# Altium schematic sheet MOSFETs.SchDoc
size A; SheetNumber: 6; SheetTotal: 8
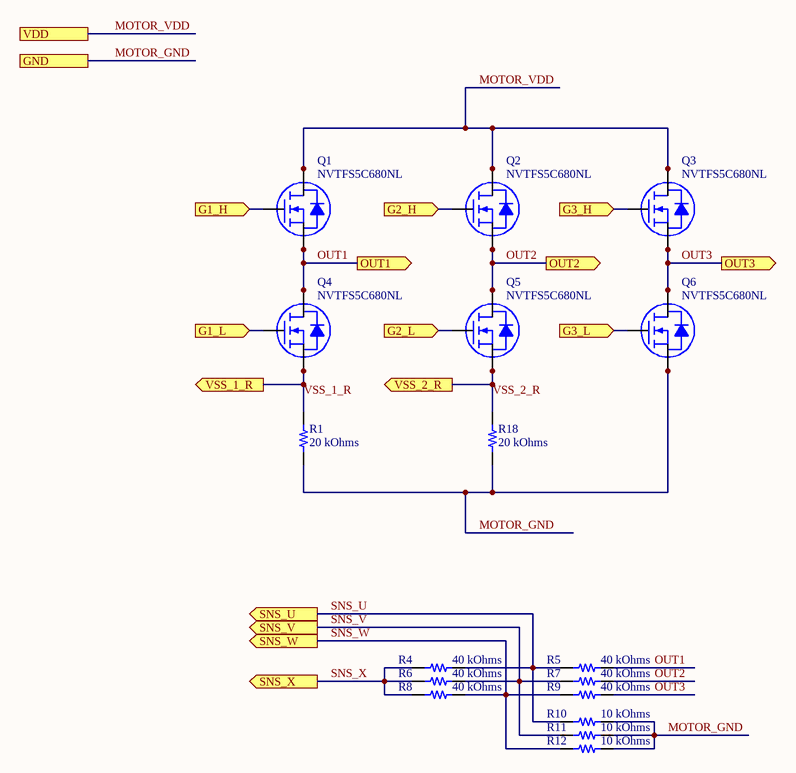
[diagram p0: MOSFETs.SchDoc]

## Parts
Q1  NVTFS5C680NL  [NVTFS015N04CTAG]
Q2  NVTFS5C680NL  [NVTFS015N04CTAG]
Q3  NVTFS5C680NL  [NVTFS015N04CTAG]
Q4  NVTFS5C680NL  [NVTFS015N04CTAG]
Q5  NVTFS5C680NL  [NVTFS015N04CTAG]
Q6  NVTFS5C680NL  [NVTFS015N04CTAG]
R1  20 kOhms  [RES 0805_2012]
R4  40 kOhms  [RES 0402_1005]
R5  40 kOhms  [RES 0402_1005]
R6  40 kOhms  [RES 0402_1005]
R7  40 kOhms  [RES 0402_1005]
R8  40 kOhms  [RES 0402_1005]
R9  40 kOhms  [RES 0402_1005]
R10  10 kOhms  [RES 0402_1005]
R11  10 kOhms  [RES 0402_1005]
R12  10 kOhms  [RES 0402_1005]
R18  20 kOhms  [RES 0805_2012]

## Ports
G1_H (in), G1_L (in), G2_H (in), G2_L (in), G3_H (in), G3_L (in), GND, OUT1 (out), OUT2 (out), OUT3 (out), SNS_U (out), SNS_V (out), SNS_W (out), SNS_X (out), VDD, VSS_1_R (out), VSS_2_R (out)

## Nets
G1_H: Q1.4(G) ; port G1_H
G1_L: Q4.4(G) ; port G1_L
G2_H: Q2.4(G) ; port G2_H
G2_L: Q5.4(G) ; port G2_L
G3_H: Q3.4(G) ; port G3_H
G3_L: Q6.4(G) ; port G3_L
MOTOR_GND: Q6.1(S) Q6.2(S) Q6.3(S) R1.1 R10.1 R11.1 R12.1 R18.1 ; port GND
MOTOR_VDD: Q1.5(D) Q1.6(D) Q1.7(D) Q1.8(D) Q2.5(D) Q2.6(D) Q2.7(D) Q2.8(D) Q3.5(D) Q3.6(D) Q3.7(D) Q3.8(D) ; port VDD
OUT1: Q1.1(S) Q1.2(S) Q1.3(S) Q4.5(D) Q4.6(D) Q4.7(D) Q4.8(D) R5.2 ; port OUT1
OUT2: Q2.1(S) Q2.2(S) Q2.3(S) Q5.5(D) Q5.6(D) Q5.7(D) Q5.8(D) R7.2 ; port OUT2
OUT3: Q3.1(S) Q3.2(S) Q3.3(S) Q6.5(D) Q6.6(D) Q6.7(D) Q6.8(D) R9.2 ; port OUT3
SNS_U: R4.2 R5.1 R10.2 ; port SNS_U
SNS_V: R6.2 R7.1 R11.2 ; port SNS_V
SNS_W: R8.2 R9.1 R12.2 ; port SNS_W
SNS_X: R4.1 R6.1 R8.1 ; port SNS_X
VSS_1_R: Q4.1(S) Q4.2(S) Q4.3(S) R1.2 ; port VSS_1_R
VSS_2_R: Q5.1(S) Q5.2(S) Q5.3(S) R18.2 ; port VSS_2_R

## Library data of the parts
Q1-Q6 = NVTFS5C680NL: N-FET
R1 R18 = PCAN0805E2002BST5: RES SMD 20K OHM 0.1% 1W 0805; Manufacturer: Vishay Thin Film; Temperature Coefficient: ±25ppm/°C; Part Number: PCAN0805E2002BST5; Value: 20 kOhms; ComponentLink1Description: Datasheet; ComponentLink1URL: http://www.vishay.com/docs/60125/pcan.pdf; ComponentLink2Description: DigiKey Link; ComponentLink2URL: http://digikey.com/product-detail/en/vishay-thin-film/PCAN0805E2002BST5/764-1242-1-ND/6003316; Composition: Thin Film; Device Package: 0805 (2012 Metric); Features: Flame Proof, Moisture Resistant, Safety; Height - Seated (Max): 0.018" (0.46mm); LastUpdated: 8/26/2022 12:02:22 PM; Lifecycle Status: Active; Minimum Order: 1; Number of Terminations: 2; Operating Temperature: -55°C ~ 155°C; Package / Case: 0805 (2012 Metric); Packaging: TapeAndReel; PartId: 32096; Part Status: Active; Power (Watts): 1W; Price: 0.59; Resistance: 20 kOhms; Series: PCAN; Size / Dimension: 0.080" L x 0.050" W (2.03mm x 1.27mm); Supplier 1: DigiKey; Supplier Part Number 1: 764-1242-1-ND; Supplier Device Package: 0805; Tolerance: ±0.1%
R4-R12 = RK73H1ETTP1432F: RES 14.3K OHM 1% 1/10W 0402; Manufacturer: KOA Speer Electronics, Inc.; Power (Watts): 0.1W, 1/10W; Resistance: 14.3 kOhms; Temperature Coefficient: ±100ppm/°C; Part Number: RK73H1ETTP1432F; ComponentLink1Description: Datasheet; ComponentLink1URL: http://www.koaspeer.com/catimages/Products/RK73H/RK73H.pdf; ComponentLink2Description: DigiKey Link; ComponentLink2URL: https://www.digikey.com/en/products/detail/koa-speer-electronics-inc/RK73H1ETTP1432F/9844351; Composition: Thick Film; Device Package: 0402 (1005 Metric); Features: Automotive AEC-Q200, Moisture Resistant; Height - Seated (Max): 0.016" (0.40mm); LastUpdated: 8/14/2022 9:23:49 PM; Lifecycle Status: Active; Minimum Order: 1; Number of Terminations: 2; Operating Temperature: -55°C ~ 155°C; Package / Case: 0402 (1005 Metric); Packaging: CutTape; PartId: 10193; Part Status: Active; Price: 0.01; Ratings: AEC-Q200; Series: RK73H; Size / Dimension: 0.039" L x 0.020" W (1.00mm x 0.50mm); Supplier 1: DigiKey; Supplier Part Number 1: 2019-RK73H1ETTP1432FCT-ND; Supplier Device Package: 0402; Tolerance: ±1%
  R4-R9: Value: 40 kOhms
  R10-R12: Value: 10 kOhms